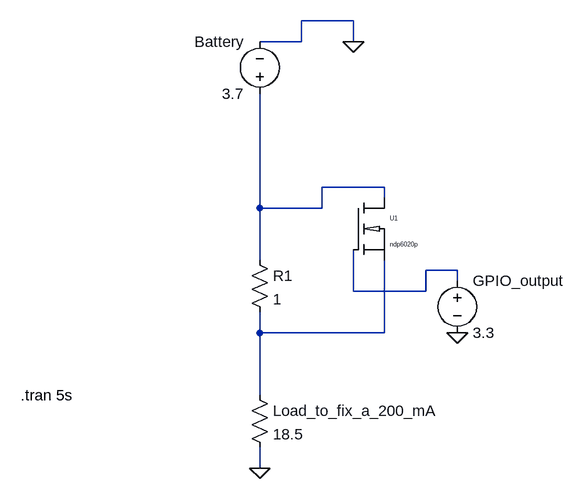
[diagram p0: schematic ndp6020p_simulation.asc]
ndp6020p_simulation.asc, the LTspice schematic file:
Version 4
SHEET 1 880 680
WIRE 288 -208 208 -208
WIRE 208 -176 208 -208
WIRE 208 -176 144 -176
WIRE 288 -176 288 -208
WIRE 336 48 240 48
WIRE 336 64 336 48
WIRE 144 80 144 -96
WIRE 240 80 240 48
WIRE 240 80 144 80
WIRE 144 160 144 80
WIRE 448 176 400 176
WIRE 448 192 448 176
WIRE 288 208 288 144
WIRE 400 208 400 176
WIRE 400 208 288 208
WIRE 144 272 144 240
WIRE 336 272 336 160
WIRE 336 272 144 272
WIRE 144 368 144 272
WIRE 144 480 144 448
FLAG 288 -176 0
FLAG 448 272 0
FLAG 144 480 0
SYMBOL voltage 144 -80 R180
WINDOW 0 24 96 Left 2
WINDOW 3 24 16 Left 2
WINDOW 123 0 0 Left 0
WINDOW 39 24 68 Left 2
SYMATTR InstName Battery
SYMATTR Value 3.7
SYMBOL res 128 144 R0
SYMATTR InstName R1
SYMATTR Value 1
SYMBOL voltage 448 176 R0
WINDOW 123 0 0 Left 0
WINDOW 39 0 0 Left 0
SYMATTR InstName GPIO_output
SYMATTR Value 3.3
SYMBOL res 128 352 R0
SYMATTR InstName Load_to_fix_a_200_mA
SYMATTR Value 18.5
SYMBOL ndp6020p 288 64 R0
SYMATTR InstName U1
TEXT -224 368 Left 2 !.tran 5s

The netlist it stands for:
* ndp6020p_simulation.asc
V§Battery N001 0 3.7
R1 N001 N003 1
V§GPIO_output N002 0 3.3
R§Load_to_fix_a_200_mA N003 0 18.5
XU1 N001 N002 N003 ndp6020p  ; pins D G S
.tran 5s
.lib ndp6020p.lib
.backanno
.end